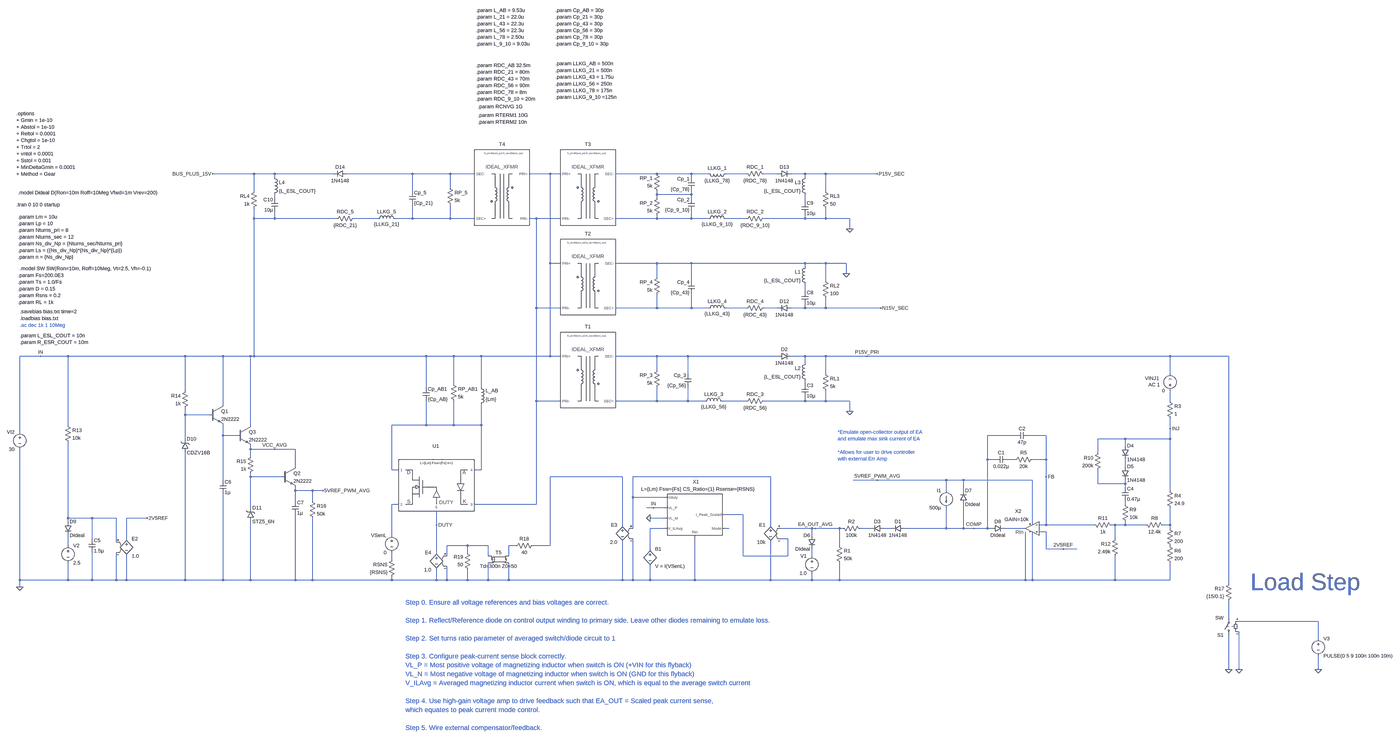
[diagram p0: schematic SU_PSU_Averaged_Model_Diode_Refed_to_Primary_Side.asc, whole sheet]
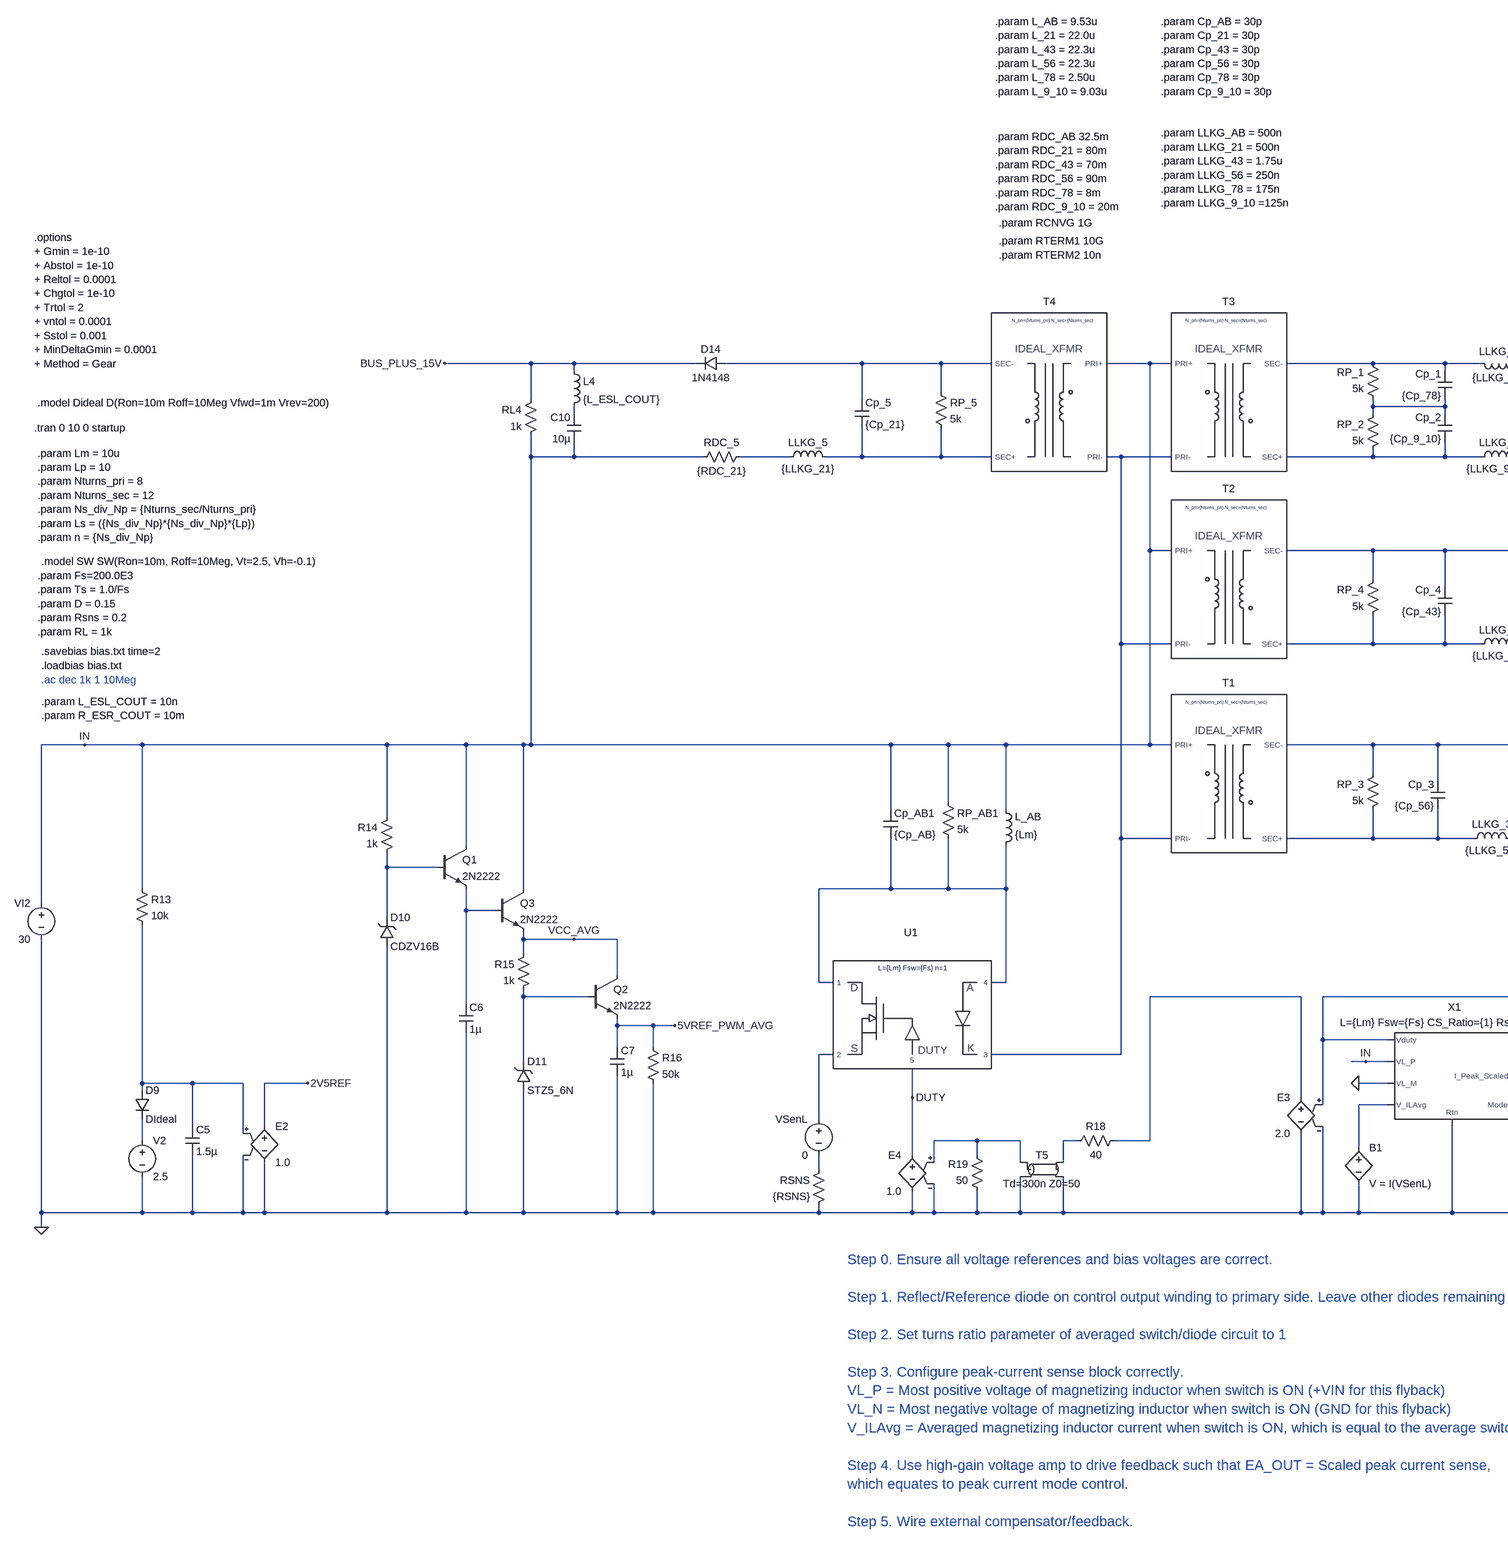
[diagram p1: schematic SU_PSU_Averaged_Model_Diode_Refed_to_Primary_Side.asc, part, row 1 of 1, column 1 of 2]
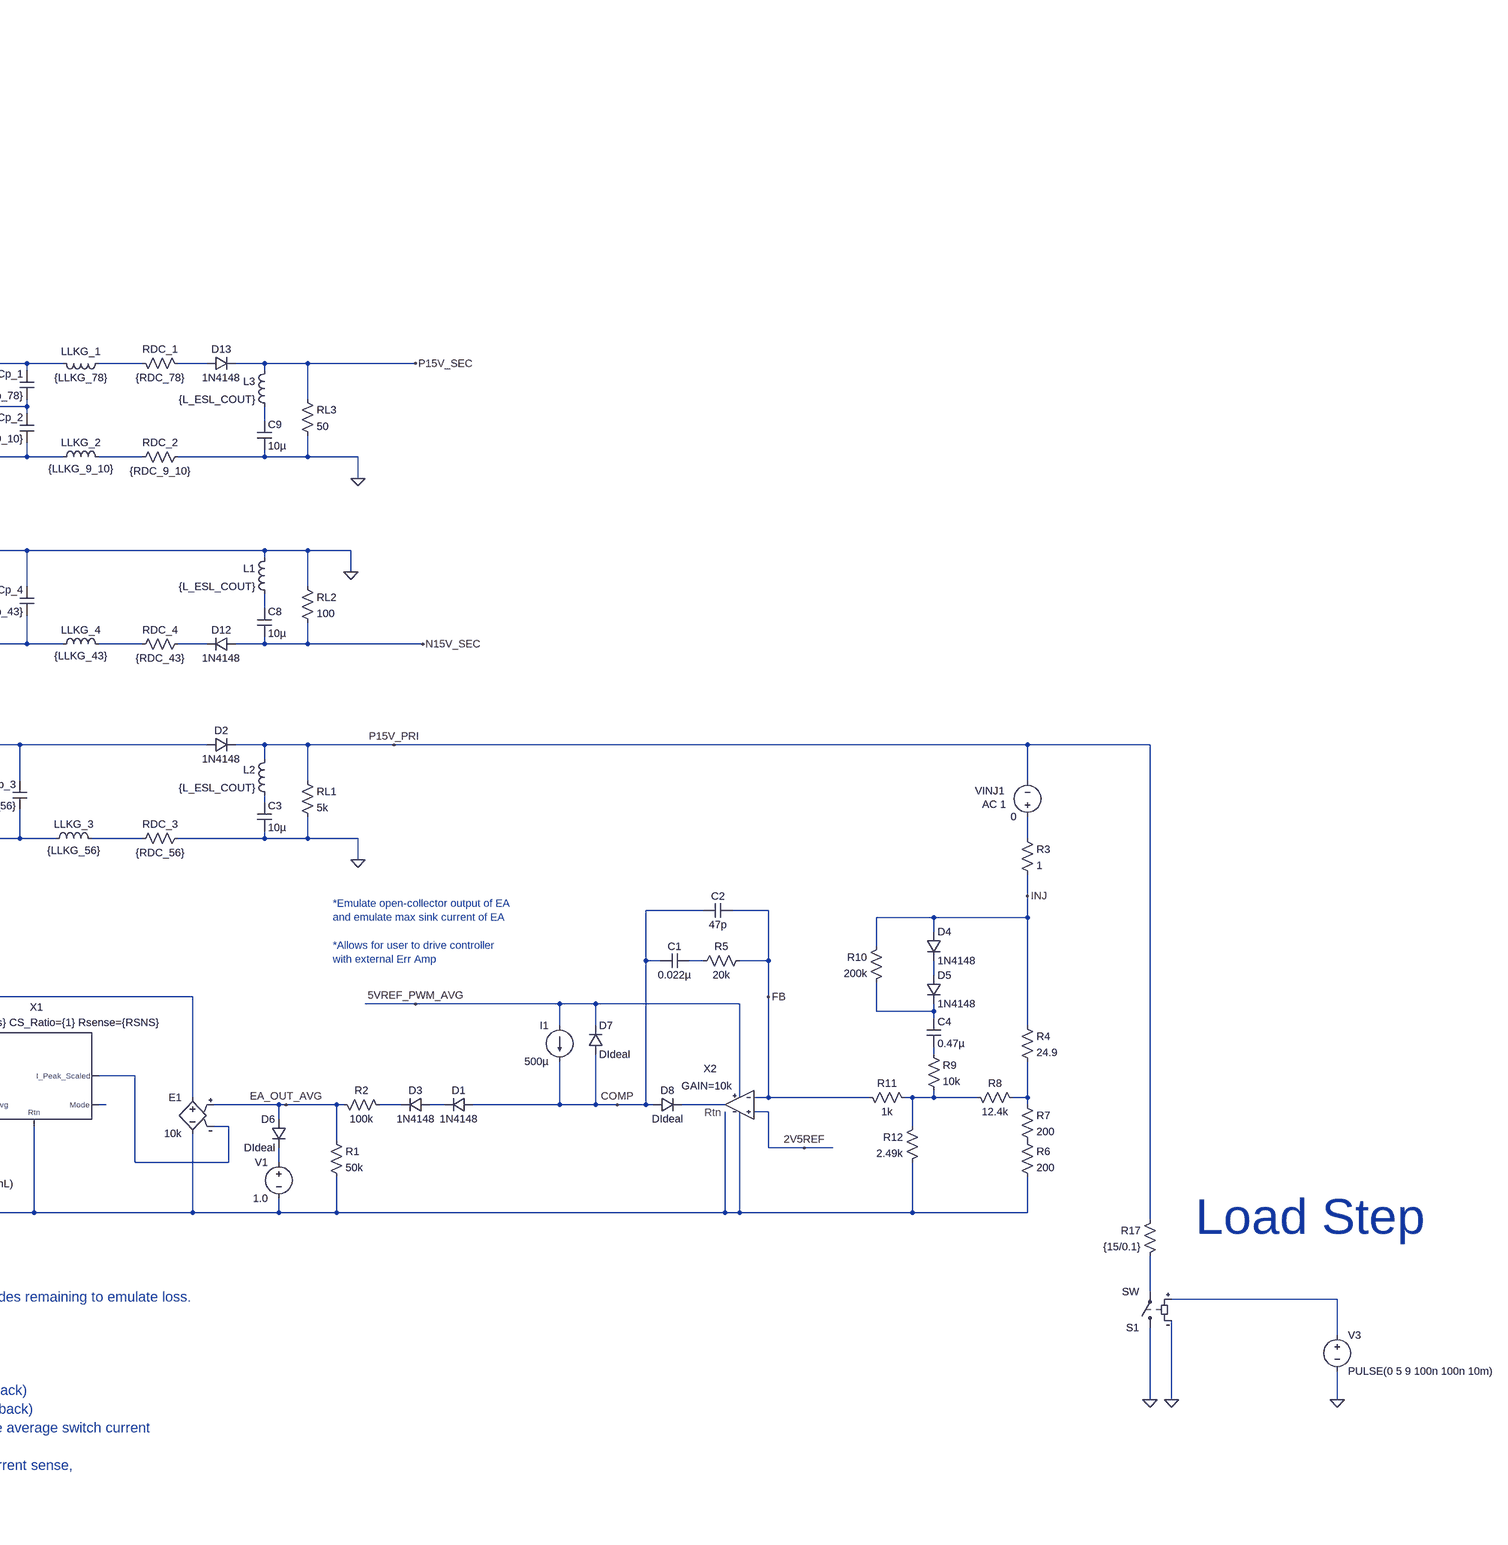
[diagram p2: schematic SU_PSU_Averaged_Model_Diode_Refed_to_Primary_Side.asc, part, row 1 of 1, column 2 of 2]
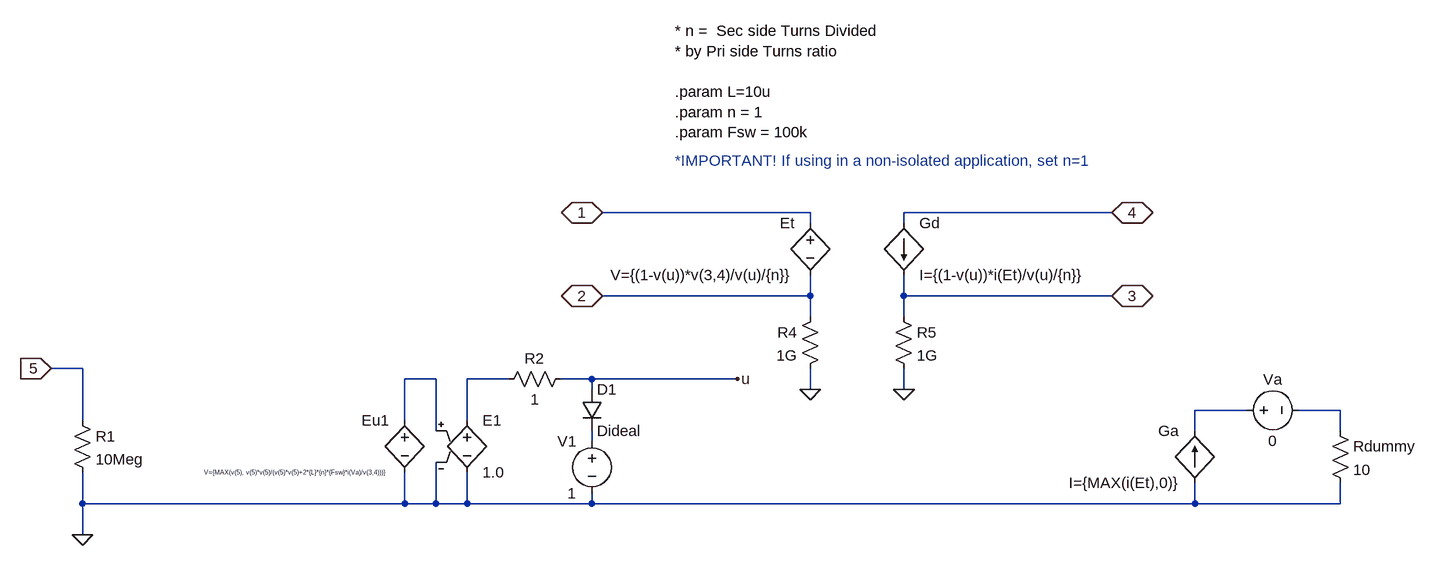
[diagram p3: sub-circuit ccm-dcm2.asc]
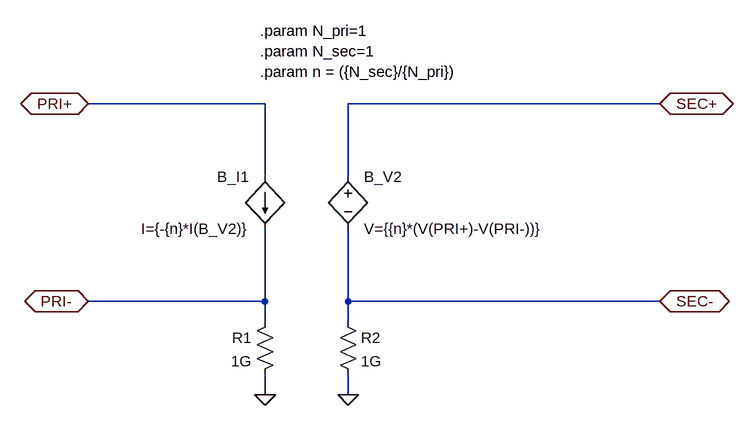
[diagram p4: sub-circuit ideal_dc_xfmr_alt.asc]
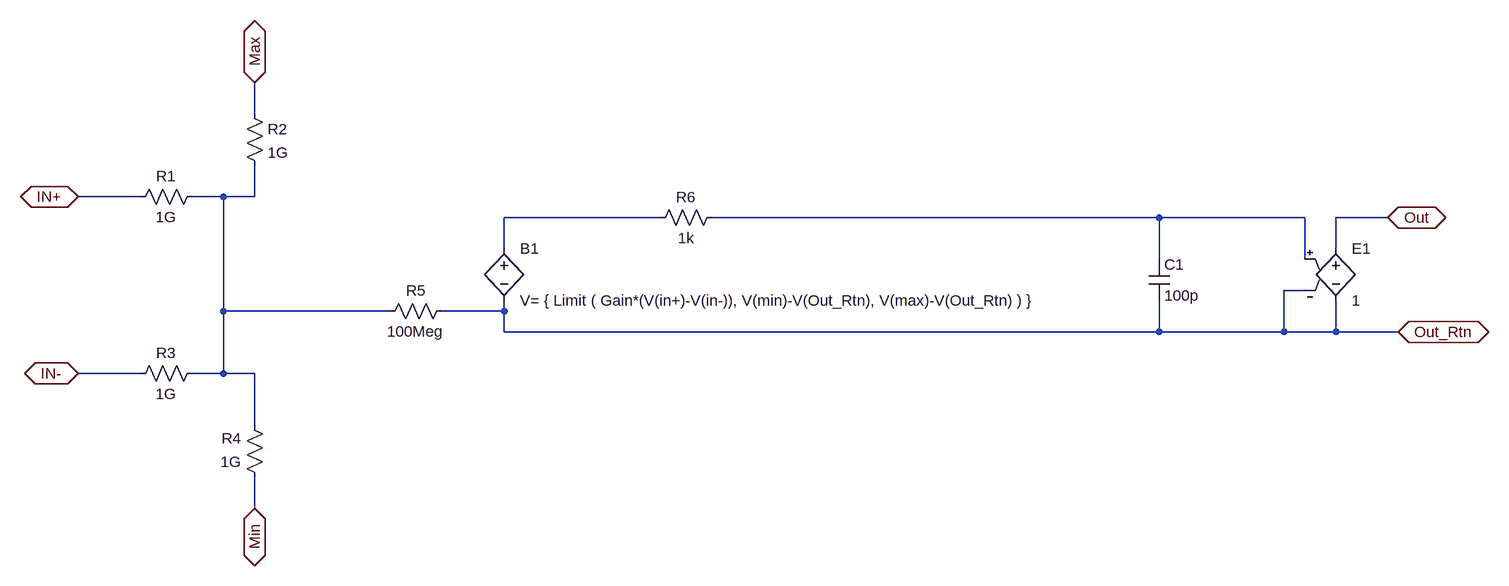
[diagram p5: sub-circuit voltage_amp.asc]
SU_PSU_Averaged_Model_Diode_Refed_to_Primary_Side.asc, the LTspice schematic file:
Version 4.1
SHEET 1 4536 3592
WIRE -912 496 -1104 496
WIRE -816 496 -912 496
WIRE -544 496 -816 496
WIRE -176 496 -480 496
WIRE 0 496 -176 496
WIRE 112 496 0 496
WIRE 464 496 368 496
WIRE 512 496 464 496
WIRE 960 496 768 496
WIRE 1120 496 960 496
WIRE 1200 496 1120 496
WIRE 1376 496 1280 496
WIRE 1520 496 1456 496
WIRE 1648 496 1584 496
WIRE 1744 496 1648 496
WIRE 1984 496 1744 496
WIRE -816 512 -816 496
WIRE 1120 512 1120 496
WIRE 1648 512 1648 496
WIRE 0 560 0 496
WIRE -912 576 -912 496
WIRE -176 576 -176 496
WIRE 1744 576 1744 496
WIRE 960 592 960 576
WIRE 1120 592 1120 576
WIRE 1120 592 960 592
WIRE -816 608 -816 592
WIRE 960 608 960 592
WIRE 1120 608 1120 592
WIRE 1648 624 1648 592
WIRE -912 704 -912 656
WIRE -816 704 -816 672
WIRE -816 704 -912 704
WIRE -528 704 -816 704
WIRE -336 704 -448 704
WIRE -176 704 -176 640
WIRE -176 704 -256 704
WIRE 0 704 0 640
WIRE 0 704 -176 704
WIRE 112 704 0 704
WIRE 400 704 368 704
WIRE 512 704 400 704
WIRE 960 704 960 688
WIRE 960 704 768 704
WIRE 1120 704 1120 672
WIRE 1120 704 960 704
WIRE 1200 704 1120 704
WIRE 1376 704 1280 704
WIRE 1648 704 1648 688
WIRE 1648 704 1456 704
WIRE 1744 704 1744 656
WIRE 1744 704 1648 704
WIRE 1856 704 1744 704
WIRE 1856 752 1856 704
WIRE 464 912 464 496
WIRE 512 912 464 912
WIRE 960 912 768 912
WIRE 1120 912 960 912
WIRE 1648 912 1120 912
WIRE 1744 912 1648 912
WIRE 1840 912 1744 912
WIRE 1648 928 1648 912
WIRE 1840 960 1840 912
WIRE 960 976 960 912
WIRE 1120 992 1120 912
WIRE 1744 992 1744 912
WIRE 1648 1040 1648 1008
WIRE 400 1120 400 704
WIRE 512 1120 400 1120
WIRE 960 1120 960 1056
WIRE 960 1120 768 1120
WIRE 1120 1120 1120 1056
WIRE 1120 1120 960 1120
WIRE 1200 1120 1120 1120
WIRE 1376 1120 1280 1120
WIRE 1520 1120 1456 1120
WIRE 1648 1120 1648 1104
WIRE 1648 1120 1584 1120
WIRE 1744 1120 1744 1072
WIRE 1744 1120 1648 1120
WIRE 2000 1120 1744 1120
WIRE -1904 1344 -2000 1344
WIRE -1776 1344 -1904 1344
WIRE -1232 1344 -1776 1344
WIRE -1056 1344 -1232 1344
WIRE -928 1344 -1056 1344
WIRE -912 1344 -912 704
WIRE -912 1344 -928 1344
WIRE -112 1344 -912 1344
WIRE 16 1344 -112 1344
WIRE 144 1344 16 1344
WIRE 464 1344 464 912
WIRE 464 1344 144 1344
WIRE 512 1344 464 1344
WIRE 960 1344 768 1344
WIRE 1104 1344 960 1344
WIRE 1520 1344 1104 1344
WIRE 1648 1344 1584 1344
WIRE 1744 1344 1648 1344
WIRE 1936 1344 1744 1344
WIRE 3344 1344 1936 1344
WIRE 3648 1344 3344 1344
WIRE 1648 1376 1648 1344
WIRE 960 1408 960 1344
WIRE 1104 1424 1104 1344
WIRE 1744 1424 1744 1344
WIRE 3344 1424 3344 1344
WIRE 16 1472 16 1344
WIRE 1648 1472 1648 1456
WIRE -112 1488 -112 1344
WIRE 144 1488 144 1344
WIRE -1232 1504 -1232 1344
WIRE 400 1552 400 1120
WIRE 512 1552 400 1552
WIRE 960 1552 960 1488
WIRE 960 1552 768 1552
WIRE 1104 1552 1104 1488
WIRE 1104 1552 960 1552
WIRE 1184 1552 1104 1552
WIRE 1376 1552 1264 1552
WIRE 1648 1552 1648 1536
WIRE 1648 1552 1456 1552
WIRE 1744 1552 1744 1504
WIRE 1744 1552 1648 1552
WIRE 1856 1552 1744 1552
WIRE 3344 1552 3344 1504
WIRE -1056 1568 -1056 1344
WIRE 1856 1600 1856 1552
WIRE -1232 1616 -1232 1584
WIRE -1120 1616 -1232 1616
WIRE -1776 1664 -1776 1344
WIRE -928 1664 -928 1344
WIRE -112 1664 -112 1552
WIRE -112 1664 -272 1664
WIRE 16 1664 16 1552
WIRE 16 1664 -112 1664
WIRE 144 1664 144 1568
WIRE 144 1664 16 1664
WIRE 3344 1680 3344 1632
WIRE -2000 1696 -2000 1344
WIRE -1056 1712 -1056 1664
WIRE -992 1712 -1056 1712
WIRE 2624 1712 2496 1712
WIRE 2768 1712 2688 1712
WIRE -1232 1728 -1232 1616
WIRE 3136 1728 3008 1728
WIRE 3344 1728 3344 1680
WIRE 3344 1728 3136 1728
WIRE 3136 1760 3136 1728
WIRE -928 1776 -928 1760
WIRE -816 1776 -928 1776
WIRE -720 1776 -816 1776
WIRE 3008 1792 3008 1728
WIRE -928 1808 -928 1776
WIRE 2496 1824 2496 1712
WIRE 2528 1824 2496 1824
WIRE 2624 1824 2592 1824
WIRE 2768 1824 2768 1712
WIRE 2768 1824 2704 1824
WIRE -720 1856 -720 1776
WIRE 3136 1856 3136 1824
WIRE -272 1872 -272 1664
WIRE -240 1872 -272 1872
WIRE 144 1872 144 1664
WIRE 144 1872 112 1872
WIRE -928 1904 -928 1888
WIRE -784 1904 -928 1904
WIRE 800 1904 464 1904
WIRE 1488 1904 848 1904
WIRE 2768 1904 2768 1824
WIRE -1056 1920 -1056 1712
WIRE 1984 1920 1872 1920
WIRE 2304 1920 1984 1920
WIRE 2384 1920 2304 1920
WIRE 2704 1920 2384 1920
WIRE 3008 1936 3008 1872
WIRE 3136 1936 3136 1920
WIRE 3136 1936 3008 1936
WIRE 3136 1952 3136 1936
WIRE -720 1968 -720 1952
WIRE -640 1968 -720 1968
WIRE -592 1968 -640 1968
WIRE 2304 1968 2304 1920
WIRE 2384 1968 2384 1920
WIRE 3344 1968 3344 1728
WIRE 848 2000 848 1904
WIRE 992 2000 848 2000
WIRE -720 2016 -720 1968
WIRE -640 2016 -640 1968
WIRE -240 2032 -272 2032
WIRE 400 2032 400 1552
WIRE 400 2032 112 2032
WIRE 3136 2032 3136 2016
WIRE -928 2048 -928 1904
WIRE 944 2048 912 2048
WIRE 992 2048 944 2048
WIRE 1360 2080 1280 2080
WIRE -1776 2096 -1776 1744
WIRE -1664 2096 -1776 2096
WIRE -1552 2096 -1664 2096
WIRE -1408 2096 -1504 2096
WIRE 992 2096 928 2096
WIRE -1776 2112 -1776 2096
WIRE -64 2128 -64 2064
WIRE 800 2128 800 1904
WIRE 1488 2128 1488 1904
WIRE 2704 2128 2704 1920
WIRE 2768 2128 2768 1904
WIRE 2768 2128 2736 2128
WIRE 2992 2128 2768 2128
WIRE 3088 2128 3072 2128
WIRE 3136 2128 3136 2112
WIRE 3136 2128 3088 2128
WIRE 3232 2128 3136 2128
WIRE 3344 2128 3344 2048
WIRE 3344 2128 3312 2128
WIRE 848 2144 848 2000
WIRE 992 2144 928 2144
WIRE 1296 2144 1280 2144
WIRE 1680 2144 1536 2144
WIRE 1696 2144 1680 2144
WIRE 1808 2144 1696 2144
WIRE 1824 2144 1808 2144
WIRE 1952 2144 1904 2144
WIRE 2048 2144 2016 2144
WIRE 2304 2144 2304 2048
WIRE 2304 2144 2112 2144
WIRE 2384 2144 2384 2032
WIRE 2384 2144 2304 2144
WIRE 2432 2144 2384 2144
WIRE 2496 2144 2496 1824
WIRE 2496 2144 2432 2144
WIRE 2512 2144 2496 2144
WIRE 2672 2144 2576 2144
WIRE 3344 2144 3344 2128
WIRE 2768 2160 2736 2160
WIRE -272 2176 -272 2032
WIRE 1680 2176 1680 2144
WIRE -1664 2192 -1664 2096
WIRE -1504 2192 -1504 2096
WIRE 1568 2192 1536 2192
WIRE 3088 2192 3088 2128
WIRE -1552 2208 -1552 2096
WIRE -1776 2224 -1776 2176
WIRE 80 2224 -16 2224
WIRE 176 2224 80 2224
WIRE 304 2224 272 2224
WIRE 464 2224 464 1904
WIRE 464 2224 384 2224
WIRE 1808 2224 1808 2144
WIRE 928 2240 928 2144
WIRE 2768 2240 2768 2160
WIRE 2848 2240 2768 2240
WIRE 2912 2240 2848 2240
WIRE -64 2256 -64 2128
WIRE 80 2256 80 2224
WIRE -16 2272 -16 2224
WIRE 176 2272 176 2224
WIRE 272 2272 272 2224
WIRE 1360 2272 1360 2080
WIRE 1568 2272 1568 2192
WIRE 1568 2272 1360 2272
WIRE 1680 2272 1680 2240
WIRE -272 2288 -272 2256
WIRE -2000 2384 -2000 1776
WIRE -1776 2384 -1776 2304
WIRE -1776 2384 -2000 2384
WIRE -1664 2384 -1664 2256
WIRE -1664 2384 -1776 2384
WIRE -1552 2384 -1552 2256
WIRE -1552 2384 -1664 2384
WIRE -1504 2384 -1504 2272
WIRE -1504 2384 -1552 2384
WIRE -1232 2384 -1232 1792
WIRE -1232 2384 -1504 2384
WIRE -1056 2384 -1056 1984
WIRE -1056 2384 -1232 2384
WIRE -928 2384 -928 2112
WIRE -928 2384 -1056 2384
WIRE -720 2384 -720 2080
WIRE -720 2384 -928 2384
WIRE -640 2384 -640 2096
WIRE -640 2384 -720 2384
WIRE -272 2384 -272 2368
WIRE -272 2384 -640 2384
WIRE -64 2384 -64 2336
WIRE -64 2384 -272 2384
WIRE -16 2384 -16 2320
WIRE -16 2384 -64 2384
WIRE 80 2384 80 2336
WIRE 80 2384 -16 2384
WIRE 176 2384 176 2304
WIRE 176 2384 80 2384
WIRE 272 2384 272 2304
WIRE 272 2384 176 2384
WIRE 800 2384 800 2208
WIRE 800 2384 272 2384
WIRE 848 2384 848 2192
WIRE 848 2384 800 2384
WIRE 928 2384 928 2320
WIRE 928 2384 848 2384
WIRE 1136 2384 1136 2192
WIRE 1136 2384 928 2384
WIRE 1488 2384 1488 2208
WIRE 1488 2384 1136 2384
WIRE 1680 2384 1680 2352
WIRE 1680 2384 1488 2384
WIRE 1808 2384 1808 2304
WIRE 1808 2384 1680 2384
WIRE 2672 2384 2672 2160
WIRE 2672 2384 1808 2384
WIRE 2704 2384 2704 2160
WIRE 2704 2384 2672 2384
WIRE 3088 2384 3088 2272
WIRE 3088 2384 2704 2384
WIRE 3344 2384 3344 2304
WIRE 3344 2384 3088 2384
WIRE 3648 2400 3648 1344
WIRE -2000 2416 -2000 2384
WIRE 3648 2560 3648 2480
WIRE 4064 2576 3696 2576
WIRE 4064 2656 4064 2576
WIRE 3648 2800 3648 2640
WIRE 3696 2800 3696 2624
WIRE 4064 2800 4064 2736
FLAG -2000 2416 0
FLAG 1936 1344 P15V_PRI
FLAG -1904 1344 IN
FLAG 1856 1600 0
FLAG 1696 2144 EA_OUT_AVG
FLAG 2848 2240 2V5REF
FLAG 1984 1920 5VREF_PWM_AVG
FLAG 3344 1680 INJ
FLAG 928 2096 0
FLAG 2768 1904 FB
FLAG 2432 2144 COMP
FLAG -1408 2096 2V5REF
FLAG -816 1776 VCC_AVG
FLAG -592 1968 5VREF_PWM_AVG
FLAG -64 2128 DUTY
FLAG 2000 1120 N15V_SEC
FLAG 1840 960 0
FLAG 1984 496 P15V_SEC
FLAG 1856 752 0
FLAG -1104 496 BUS_PLUS_15V
FLAG 3648 2800 0
FLAG 3696 2800 0
FLAG 4064 2800 0
FLAG 944 2048 IN
DATAFLAG 2912 1344 ""
DATAFLAG 1888 1120 ""
DATAFLAG -1024 496 ""
DATAFLAG 1856 496 ""
DATAFLAG 2880 2128 ""
DATAFLAG 2224 2144 ""
DATAFLAG 2224 2144 ""
DATAFLAG 944 1904 ""
DATAFLAG 1568 2144 ""
DATAFLAG -272 2064 ""
SYMBOL voltage -2000 1680 M0
WINDOW 123 0 0 Left 0
WINDOW 39 0 0 Left 0
SYMATTR InstName VI2
SYMATTR Value 30
SYMBOL res 1728 1408 R0
SYMATTR InstName RL1
SYMATTR Value 5k
SYMBOL cap 1632 1472 R0
SYMATTR InstName C3
SYMATTR Value 10µ
SYMBOL ccm-dcm2 -64 1952 R0
WINDOW 39 2 -102 Bottom 1
SYMATTR SpiceLine L={Lm} Fsw={Fs} n=1
SYMATTR InstName U1
SYMBOL res -256 2272 M0
SYMATTR InstName RSNS
SYMATTR Value {RSNS}
SYMBOL ind 128 1584 M180
WINDOW 0 36 80 Left 2
WINDOW 3 36 40 Left 2
SYMATTR InstName L_AB
SYMATTR Value {Lm}
SYMBOL IDEAL_DC_XFMR_ALT 640 1440 R0
WINDOW 0 -1 -218 Bottom 2
WINDOW 39 -7 -184 Bottom 0
SYMATTR InstName T1
SYMATTR SpiceLine N_pri={Nturns_pri} N_sec={Nturns_sec}
SYMBOL diode 1520 1360 R270
WINDOW 0 32 32 VTop 2
WINDOW 3 0 32 VBottom 2
SYMATTR InstName D2
SYMATTR Value 1N4148
SYMBOL Peak_Current_Sense 1136 2080 R0
WINDOW 0 5 -137 Bottom 2
WINDOW 39 14 -103 Bottom 2
SYMATTR InstName X1
SYMATTR SpiceLine L={Lm} Fsw={Fs} CS_Ratio={1} Rsense={RSNS}
SYMBOL bv 928 2224 R0
SYMATTR InstName B1
SYMATTR Value V = I(VSenL)
SYMBOL diode 2112 2160 M270
WINDOW 0 32 32 VTop 2
WINDOW 3 0 32 VBottom 2
SYMATTR InstName D1
SYMATTR Value 1N4148
SYMBOL diode 2016 2160 M270
WINDOW 0 32 32 VTop 2
WINDOW 3 0 32 VBottom 2
SYMATTR InstName D3
SYMATTR Value 1N4148
SYMBOL res 1792 2208 R0
SYMATTR InstName R1
SYMATTR Value 50k
SYMBOL res 1920 2160 M270
WINDOW 0 32 56 VTop 2
WINDOW 3 0 56 VBottom 2
SYMATTR InstName R2
SYMATTR Value 100k
SYMBOL res 3328 1536 R0
SYMATTR InstName R3
SYMATTR Value 1
SYMBOL res 3328 1952 R0
SYMATTR InstName R4
SYMATTR Value 24.9
SYMBOL cap 2592 1808 R90
WINDOW 0 0 32 VBottom 2
WINDOW 3 32 32 VTop 2
SYMATTR InstName C1
SYMATTR Value 0.022µ
SYMBOL res 2720 1808 R90
WINDOW 0 0 56 VBottom 2
WINDOW 3 32 56 VTop 2
SYMATTR InstName R5
SYMATTR Value 20k
SYMBOL cap 2688 1696 R90
WINDOW 0 0 32 VBottom 2
WINDOW 3 32 32 VTop 2
SYMATTR InstName C2
SYMATTR Value 47p
SYMBOL res 3328 2208 R0
SYMATTR InstName R6
SYMATTR Value 200
SYMBOL res 3328 2128 R0
SYMATTR InstName R7
SYMATTR Value 200
SYMBOL res 3216 2112 M90
WINDOW 0 0 56 VBottom 2
WINDOW 3 32 56 VTop 2
SYMATTR InstName R8
SYMATTR Value 12.4k
SYMBOL res 3120 2016 R0
SYMATTR InstName R9
SYMATTR Value 10k
SYMBOL cap 3120 1952 R0
SYMATTR InstName C4
SYMATTR Value 0.47µ
SYMBOL res 3024 1776 M0
SYMATTR InstName R10
SYMATTR Value 200k
SYMBOL res 2976 2112 M90
WINDOW 0 0 56 VBottom 2
WINDOW 3 32 56 VTop 2
SYMATTR InstName R11
SYMATTR Value 1k
SYMBOL res 3104 2176 M0
SYMATTR InstName R12
SYMATTR Value 2.49k
SYMBOL e 1488 2112 M0
SYMATTR InstName E1
SYMATTR Value 10k
SYMBOL diode 3120 1760 R0
SYMATTR InstName D4
SYMATTR Value 1N4148
SYMBOL diode 3120 1856 R0
SYMATTR InstName D5
SYMATTR Value 1N4148
SYMBOL voltage 1680 2256 M0
WINDOW 123 0 0 Left 0
WINDOW 39 0 0 Left 0
SYMATTR InstName V1
SYMATTR Value 1.0
SYMBOL diode 1696 2176 M0
SYMATTR InstName D6
SYMATTR Value DIdeal
SYMBOL current 2304 1968 M0
WINDOW 123 0 0 Left 0
WINDOW 39 0 0 Left 0
SYMATTR InstName I1
SYMATTR Value 500µ
SYMBOL diode 2368 2032 M180
WINDOW 0 24 64 Left 2
WINDOW 3 24 0 Left 2
SYMATTR InstName D7
SYMATTR Value DIdeal
SYMBOL diode 2512 2128 M90
WINDOW 0 0 32 VBottom 2
WINDOW 3 32 32 VTop 2
SYMATTR InstName D8
SYMATTR Value DIdeal
SYMBOL voltage 3344 1520 R180
WINDOW 0 51 74 Left 2
WINDOW 3 24 16 Left 2
WINDOW 123 47 44 Left 2
WINDOW 39 0 0 Left 0
SYMATTR InstName VINJ1
SYMATTR Value 0
SYMATTR Value2 AC 1
SYMBOL voltage -1776 2208 R0
WINDOW 123 0 0 Left 0
WINDOW 39 0 0 Left 0
SYMATTR InstName V2
SYMATTR Value 2.5
SYMBOL res -1792 1648 R0
SYMATTR InstName R13
SYMATTR Value 10k
SYMBOL diode -1792 2112 R0
SYMATTR InstName D9
SYMATTR Value DIdeal
SYMBOL cap -1680 2192 R0
SYMATTR InstName C5
SYMATTR Value 1.5µ
SYMBOL zener -1248 1792 M180
WINDOW 0 24 64 Left 2
WINDOW 3 24 0 Left 2
SYMATTR InstName D10
SYMATTR Value CDZV16B
SYMBOL res -1216 1488 M0
SYMATTR InstName R14
SYMATTR Value 1k
SYMBOL npn -1120 1568 R0
SYMATTR InstName Q1
SYMATTR Value 2N2222
SYMBOL cap -1072 1920 R0
SYMATTR InstName C6
SYMATTR Value 1µ
SYMBOL zener -944 2112 M180
WINDOW 0 24 64 Left 2
WINDOW 3 24 0 Left 2
SYMATTR InstName D11
SYMATTR Value STZ5_6N
SYMBOL res -912 1792 M0
SYMATTR InstName R15
SYMATTR Value 1k
SYMBOL npn -784 1856 R0
SYMATTR InstName Q2
SYMATTR Value 2N2222
SYMBOL cap -736 2016 R0
SYMATTR InstName C7
SYMATTR Value 1µ
SYMBOL res -656 2000 R0
SYMATTR InstName R16
SYMATTR Value 50k
SYMBOL npn -992 1664 R0
SYMATTR InstName Q3
SYMATTR Value 2N2222
SYMBOL voltage -272 2160 M0
WINDOW 123 0 0 Left 0
WINDOW 39 0 0 Left 0
SYMATTR InstName VSenL
SYMATTR Value 0
SYMBOL Voltage_Amp 2720 2144 M0
WINDOW 0 81 -65 Bottom 2
WINDOW 39 89 -26 Bottom 2
SYMATTR InstName X2
SYMATTR SpiceLine GAIN=10k
SYMBOL e -1504 2176 R0
SYMATTR InstName E2
SYMATTR Value 1.0
SYMBOL res 1728 976 R0
SYMATTR InstName RL2
SYMATTR Value 100
SYMBOL cap 1632 1040 R0
SYMATTR InstName C8
SYMATTR Value 10µ
SYMBOL IDEAL_DC_XFMR_ALT 640 1008 R0
WINDOW 0 -1 -218 Bottom 2
WINDOW 39 -7 -184 Bottom 0
SYMATTR InstName T2
SYMATTR SpiceLine N_pri={Nturns_pri} N_sec={Nturns_sec}
SYMBOL diode 1584 1104 R90
WINDOW 0 0 32 VBottom 2
WINDOW 3 32 32 VTop 2
SYMATTR InstName D12
SYMATTR Value 1N4148
SYMBOL res 1728 560 R0
SYMATTR InstName RL3
SYMATTR Value 50
SYMBOL cap 1632 624 R0
SYMATTR InstName C9
SYMATTR Value 10µ
SYMBOL IDEAL_DC_XFMR_ALT 640 592 R0
WINDOW 0 -1 -218 Bottom 2
WINDOW 39 -7 -184 Bottom 0
SYMATTR InstName T3
SYMATTR SpiceLine N_pri={Nturns_pri} N_sec={Nturns_sec}
SYMBOL diode 1520 512 R270
WINDOW 0 32 32 VTop 2
WINDOW 3 0 32 VBottom 2
SYMATTR InstName D13
SYMATTR Value 1N4148
SYMBOL res -896 560 M0
SYMATTR InstName RL4
SYMATTR Value 1k
SYMBOL cap -800 608 M0
SYMATTR InstName C10
SYMATTR Value 10µ
SYMBOL IDEAL_DC_XFMR_ALT 240 592 M0
WINDOW 0 -1 -218 Bottom 2
WINDOW 39 -7 -184 Bottom 0
SYMATTR InstName T4
SYMATTR SpiceLine N_pri={Nturns_pri} N_sec={Nturns_sec}
SYMBOL diode -480 512 M270
WINDOW 0 32 32 VTop 2
WINDOW 3 0 32 VBottom 2
SYMATTR InstName D14
SYMATTR Value 1N4148
SYMBOL res 1472 512 M270
WINDOW 0 32 56 VTop 2
WINDOW 3 0 56 VBottom 2
SYMATTR InstName RDC_1
SYMATTR Value {RDC_78}
SYMBOL res 1472 688 R90
WINDOW 0 0 56 VBottom 2
WINDOW 3 32 56 VTop 2
SYMATTR InstName RDC_2
SYMATTR Value {RDC_9_10}
SYMBOL ind 1296 480 R90
WINDOW 0 5 56 VBottom 2
WINDOW 3 32 56 VTop 2
SYMATTR InstName LLKG_1
SYMATTR Value {LLKG_78}
SYMBOL cap 1136 576 R180
WINDOW 0 24 56 Left 2
WINDOW 3 24 8 Left 2
SYMATTR InstName Cp_1
SYMATTR Value {Cp_78}
SYMBOL res 976 592 R180
WINDOW 0 36 76 Left 2
WINDOW 3 36 40 Left 2
SYMATTR InstName RP_1
SYMATTR Value 5k
SYMBOL ind 1296 720 M270
WINDOW 0 32 56 VTop 2
WINDOW 3 5 56 VBottom 2
SYMATTR InstName LLKG_2
SYMATTR Value {LLKG_9_10}
SYMBOL cap 1136 608 M0
SYMATTR InstName Cp_2
SYMATTR Value {Cp_9_10}
SYMBOL res 976 592 M0
SYMATTR InstName RP_2
SYMATTR Value 5k
SYMBOL res 1472 1536 R90
WINDOW 0 0 56 VBottom 2
WINDOW 3 32 56 VTop 2
SYMATTR InstName RDC_3
SYMATTR Value {RDC_56}
SYMBOL ind 1280 1568 M270
WINDOW 0 32 56 VTop 2
WINDOW 3 5 56 VBottom 2
SYMATTR InstName LLKG_3
SYMATTR Value {LLKG_56}
SYMBOL cap 1120 1424 M0
SYMATTR InstName Cp_3
SYMATTR Value {Cp_56}
SYMBOL res 976 1392 M0
SYMATTR InstName RP_3
SYMATTR Value 5k
SYMBOL res 1472 1104 R90
WINDOW 0 0 56 VBottom 2
WINDOW 3 32 56 VTop 2
SYMATTR InstName RDC_4
SYMATTR Value {RDC_43}
SYMBOL ind 1296 1136 M270
WINDOW 0 32 56 VTop 2
WINDOW 3 5 56 VBottom 2
SYMATTR InstName LLKG_4
SYMATTR Value {LLKG_43}
SYMBOL cap 1136 992 M0
SYMATTR InstName Cp_4
SYMATTR Value {Cp_43}
SYMBOL res 976 960 M0
SYMATTR InstName RP_4
SYMATTR Value 5k
SYMBOL res -432 688 R90
WINDOW 0 0 56 VBottom 2
WINDOW 3 32 56 VTop 2
SYMATTR InstName RDC_5
SYMATTR Value {RDC_21}
SYMBOL ind -352 720 R270
WINDOW 0 32 56 VTop 2
WINDOW 3 5 56 VBottom 2
SYMATTR InstName LLKG_5
SYMATTR Value {LLKG_21}
SYMBOL cap -192 576 R0
SYMATTR InstName Cp_5
SYMATTR Value {Cp_21}
SYMBOL res -16 544 R0
SYMATTR InstName RP_5
SYMATTR Value 5k
SYMBOL sw 3648 2656 R180
SYMATTR InstName S1
SYMBOL res 3664 2384 M0
SYMATTR InstName R17
SYMATTR Value {15/0.1}
SYMBOL voltage 4064 2640 R0
WINDOW 123 0 0 Left 0
WINDOW 39 0 0 Left 0
SYMATTR InstName V3
SYMATTR Value PULSE(0 5 9 100n 100n 10m)
SYMBOL cap -128 1488 R0
SYMATTR InstName Cp_AB1
SYMATTR Value {Cp_AB}
SYMBOL res 0 1456 R0
SYMATTR InstName RP_AB1
SYMATTR Value 5k
SYMBOL ind 1664 912 M0
SYMATTR InstName L1
SYMATTR Value {L_ESL_COUT}
SYMATTR SpiceLine Rser={R_ESR_COUT}
SYMBOL ind 1664 1360 M0
SYMATTR InstName L2
SYMATTR Value {L_ESL_COUT}
SYMATTR SpiceLine Rser={R_ESR_COUT}
SYMBOL ind 1664 496 M0
SYMATTR InstName L3
SYMATTR Value {L_ESL_COUT}
SYMATTR SpiceLine Rser={R_ESR_COUT}
SYMBOL ind -832 496 R0
SYMATTR InstName L4
SYMATTR Value {L_ESL_COUT}
SYMATTR SpiceLine Rser={R_ESR_COUT}
SYMBOL e 800 2112 M0
SYMATTR InstName E3
SYMATTR Value 2.0
SYMBOL e -64 2240 M0
SYMATTR InstName E4
SYMATTR Value 1.0
SYMBOL tline 224 2288 R0
SYMATTR InstName T5
SYMATTR Value Td=300n Z0=50
SYMBOL res 400 2208 R90
WINDOW 0 0 56 VBottom 2
WINDOW 3 32 56 VTop 2
SYMATTR InstName R18
SYMATTR Value 40
SYMBOL res 96 2352 R180
WINDOW 0 36 76 Left 2
WINDOW 3 36 40 Left 2
SYMATTR InstName R19
SYMATTR Value 50
TEXT -2016 640 Left 2 !.tran 0 10 0 startup
TEXT -2000 936 Left 2 !.model SW SW(Ron=10m, Roff=10Meg, Vt=2.5, Vh=-0.1)
TEXT -2008 968 Left 2 !.param Fs=200.0E3\n.param Ts = 1.0/Fs\n.param D = 0.15\n.param Rsns = 0.2\n.param RL = 1k
TEXT -2008 584 Left 2 !.model Dideal D(Ron=10m Roff=10Meg Vfwd=1m Vrev=200)
TEXT -2008 696 Left 2 !.param Lm = 10u\n.param Lp = 10\n.param Nturns_pri = 8\n.param Nturns_sec = 12\n.param Ns_div_Np = {Nturns_sec/Nturns_pri}\n.param Ls = ({Ns_div_Np}*{Ns_div_Np}*{Lp})\n.param n = {Ns_div_Np}
TEXT 1800 1696 Left 2 ;*Emulate open-collector output of EA\nand emulate max sink current of EA\n \n*Allows for user to drive controller\nwith external Err Amp
TEXT -2000 1136 Left 2 !.savebias bias.txt time=2
TEXT -2000 1168 Left 2 !.loadbias bias.txt
TEXT -2000 1200 Left 2 ;.ac dec 1k 1 10Meg
TEXT -208 2488 Left 3 ;Step 0. Ensure all voltage references and bias voltages are correct.\n \nStep 1. Reflect/Reference diode on control output winding to primary side. Leave other diodes remaining to emulate loss.\n \nStep 2. Set turns ratio parameter of averaged switch/diode circuit to 1\n \nStep 3. Configure peak-current sense block correctly.\nVL_P = Most positive voltage of magnetizing inductor when switch is ON (+VIN for this flyback)\nVL_N = Most negative voltage of magnetizing inductor when switch is ON (GND for this flyback)\nV_ILAvg = Averaged magnetizing inductor current when switch is ON, which is equal to the average switch current\n \nStep 4. Use high-gain voltage amp to drive feedback such that EA_OUT = Scaled peak current sense,\nwhich equates to peak current mode control.\n \nStep 5. Wire external compensator/feedback.
TEXT 120 -264 Left 2 !.param L_AB = 9.53u\n.param L_21 = 22.0u\n.param L_43 = 22.3u\n.param L_56 = 22.3u\n.param L_78 = 2.50u\n.param L_9_10 = 9.03u
TEXT 120 -8 Left 2 !.param RDC_AB 32.5m\n.param RDC_21 = 80m\n.param RDC_43 = 70m\n.param RDC_56 = 90m\n.param RDC_78 = 8m\n.param RDC_9_10 = 20m
TEXT 128 184 Left 2 !.param RCNVG 1G
TEXT 488 -16 Left 2 !.param LLKG_AB = 500n\n.param LLKG_21 = 500n\n.param LLKG_43 = 1.75u\n.param LLKG_56 = 250n\n.param LLKG_78 = 175n\n.param LLKG_9_10 =125n
TEXT 488 -264 Left 2 !.param Cp_AB = 30p\n.param Cp_21 = 30p\n.param Cp_43 = 30p\n.param Cp_56 = 30p\n.param Cp_78 = 30p\n.param Cp_9_10 = 30p
TEXT 128 224 Left 2 !.param RTERM1 10G\n.param RTERM2 10n
TEXT 4264 2392 Right 7 ;Load Step
TEXT -2016 216 Left 2 !.options\n+ Gmin = 1e-10\n+ Abstol = 1e-10\n+ Reltol = 0.0001\n+ Chgtol = 1e-10\n+ Trtol = 2\n+ vntol = 0.0001\n+ Sstol = 0.001\n+ MinDeltaGmin = 0.0001\n+ Method = Gear
TEXT -2000 1248 Left 2 !.param L_ESL_COUT = 10n\n.param R_ESR_COUT = 10m

ccm-dcm2.asc, the sub-circuit schematic file:
Version 4.1
SHEET 1 1388 680
WIRE 432 -224 112 -224
WIRE 896 -224 576 -224
WIRE 432 -208 432 -224
WIRE 576 -208 576 -224
WIRE 432 -96 432 -128
WIRE 432 -96 112 -96
WIRE 576 -96 576 -128
WIRE 896 -96 576 -96
WIRE 432 -64 432 -96
WIRE 576 -64 576 -96
WIRE -688 16 -736 16
WIRE -144 32 -192 32
WIRE -32 32 -96 32
WIRE 96 32 48 32
WIRE 320 32 96 32
WIRE 96 48 96 32
WIRE 432 48 432 16
WIRE 576 48 576 16
WIRE 1104 80 1024 80
WIRE 1248 80 1184 80
WIRE -688 96 -688 16
WIRE -192 96 -192 32
WIRE -96 96 -96 32
WIRE -144 112 -144 32
WIRE 1024 112 1024 80
WIRE 1248 112 1248 80
WIRE 96 128 96 112
WIRE -688 224 -688 176
WIRE -192 224 -192 176
WIRE -192 224 -688 224
WIRE -144 224 -144 160
WIRE -144 224 -192 224
WIRE -96 224 -96 176
WIRE -96 224 -144 224
WIRE 96 224 96 208
WIRE 96 224 -96 224
WIRE 1024 224 1024 192
WIRE 1024 224 96 224
WIRE 1248 224 1248 192
WIRE 1248 224 1024 224
WIRE -688 272 -688 224
FLAG -736 16 5
IOPIN -736 16 In
FLAG 320 32 u
FLAG 896 -224 4
IOPIN 896 -224 BiDir
FLAG 896 -96 3
IOPIN 896 -96 BiDir
FLAG 112 -224 1
IOPIN 112 -224 BiDir
FLAG 112 -96 2
IOPIN 112 -96 BiDir
FLAG -688 272 0
FLAG 432 48 0
FLAG 576 48 0
SYMBOL bv -192 80 M0
WINDOW 3 24 96 Left 0
SYMATTR Value V={MAX(v(5), v(5)*v(5)/(v(5)*v(5)+2*{L}*{n}*{Fsw}*i(Va)/v(3,4)))}
SYMATTR InstName Eu1
SYMBOL bv 432 -224 M0
SYMATTR InstName Et
SYMATTR Value V={(1-v(u))*v(3,4)/v(u)/{n}}
SYMBOL bi 576 -208 R0
SYMATTR InstName Gd
SYMATTR Value I={(1-v(u))*i(Et)/v(u)/{n}}
SYMBOL bi 1024 192 R180
WINDOW 0 24 80 Left 2
WINDOW 3 24 0 Left 2
SYMATTR InstName Ga
SYMATTR Value I={MAX(i(Et),0)}
SYMBOL voltage 1088 80 R270
WINDOW 0 32 56 VTop 2
WINDOW 3 -32 56 VBottom 2
WINDOW 123 0 0 Left 0
WINDOW 39 0 0 Left 0
SYMATTR InstName Va
SYMATTR Value 0
SYMBOL res 1232 96 R0
SYMATTR InstName Rdummy
SYMATTR Value 10
SYMBOL e -96 80 R0
SYMATTR InstName E1
SYMATTR Value 1.0
SYMBOL res 64 16 R90
WINDOW 0 0 56 VBottom 2
WINDOW 3 32 56 VTop 2
SYMATTR InstName R2
SYMATTR Value 1
SYMBOL diode 80 48 R0
SYMATTR InstName D1
SYMATTR Value Dideal
SYMBOL voltage 96 112 M0
WINDOW 123 0 0 Left 0
WINDOW 39 0 0 Left 0
SYMATTR InstName V1
SYMATTR Value 1
SYMBOL res -704 80 R0
SYMATTR InstName R1
SYMATTR Value 10Meg
SYMBOL res 448 -80 M0
SYMATTR InstName R4
SYMATTR Value 1G
SYMBOL res 560 -80 R0
SYMATTR InstName R5
SYMATTR Value 1G
TEXT 224 -504 Left 2 !* n =  Sec side Turns Divided\n* by Pri side Turns ratio\n \n.param L=10u\n.param n = 1\n.param Fsw = 100k
TEXT 224 -304 Left 2 ;*IMPORTANT! If using in a non-isolated application, set n=1

ideal_dc_xfmr_alt.asc, the sub-circuit schematic file:
Version 4.1
SHEET 1 996 680
WIRE 192 112 -80 112
WIRE 800 112 320 112
WIRE 192 224 192 112
WIRE 320 224 320 112
WIRE 192 416 192 304
WIRE 192 416 -80 416
WIRE 320 416 320 304
WIRE 800 416 320 416
WIRE 192 448 192 416
WIRE 320 448 320 416
WIRE 192 560 192 528
WIRE 320 560 320 528
FLAG -80 112 PRI+
IOPIN -80 112 BiDir
FLAG -80 416 PRI-
IOPIN -80 416 BiDir
FLAG 800 112 SEC+
IOPIN 800 112 BiDir
FLAG 800 416 SEC-
IOPIN 800 416 BiDir
FLAG 320 560 0
FLAG 192 560 0
SYMBOL bv 320 208 R0
SYMATTR InstName B_V2
SYMATTR Value V={{n}*(V(PRI+)-V(PRI-))}
SYMBOL bi 192 224 M0
SYMATTR InstName B_I1
SYMATTR Value I={-{n}*I(B_V2)}
SYMBOL res 208 432 M0
SYMATTR InstName R1
SYMATTR Value 1G
SYMBOL res 304 432 R0
SYMATTR InstName R2
SYMATTR Value 1G
TEXT 184 0 Left 2 !.param N_pri=1\n.param N_sec=1\n.param n = ({N_sec}/{N_pri})

voltage_amp.asc, the sub-circuit schematic file:
Version 4.1
SHEET 1 2092 680
WIRE 176 -80 176 -128
WIRE 0 48 -96 48
WIRE 128 48 80 48
WIRE 176 48 176 0
WIRE 176 48 128 48
WIRE 800 80 560 80
WIRE 1568 80 880 80
WIRE 1792 80 1568 80
WIRE 1920 80 1840 80
WIRE 560 128 560 80
WIRE 1840 128 1840 80
WIRE 1568 144 1568 80
WIRE 1792 144 1792 80
WIRE 1792 192 1760 192
WIRE 128 224 128 48
WIRE 384 224 128 224
WIRE 560 224 560 208
WIRE 560 224 464 224
WIRE 560 256 560 224
WIRE 1568 256 1568 208
WIRE 1568 256 560 256
WIRE 1760 256 1760 192
WIRE 1760 256 1568 256
WIRE 1840 256 1840 208
WIRE 1840 256 1760 256
WIRE 1936 256 1840 256
WIRE 0 320 -96 320
WIRE 128 320 128 224
WIRE 128 320 80 320
WIRE 176 320 128 320
WIRE 176 400 176 320
WIRE 176 528 176 480
FLAG 176 -128 Max
IOPIN 176 -128 BiDir
FLAG -96 320 IN-
IOPIN -96 320 BiDir
FLAG 176 528 Min
IOPIN 176 528 BiDir
FLAG -96 48 IN+
IOPIN -96 48 BiDir
FLAG 1920 80 Out
IOPIN 1920 80 BiDir
FLAG 1936 256 Out_Rtn
IOPIN 1936 256 BiDir
SYMBOL res 96 32 R90
WINDOW 0 0 56 VBottom 2
WINDOW 3 32 56 VTop 2
SYMATTR InstName R1
SYMATTR Value 1G
SYMBOL res 160 -96 R0
SYMATTR InstName R2
SYMATTR Value 1G
SYMBOL res 96 304 R90
WINDOW 0 0 56 VBottom 2
WINDOW 3 32 56 VTop 2
SYMATTR InstName R3
SYMATTR Value 1G
SYMBOL res 192 496 R180
WINDOW 0 36 76 Left 2
WINDOW 3 36 40 Left 2
SYMATTR InstName R4
SYMATTR Value 1G
SYMBOL res 480 208 R90
WINDOW 0 0 56 VBottom 2
WINDOW 3 32 56 VTop 2
SYMATTR InstName R5
SYMATTR Value 100Meg
SYMBOL bv 560 112 R0
SYMATTR InstName B1
SYMATTR Value V= { Limit ( Gain*(V(in+)-V(in-)), V(min)-V(Out_Rtn), V(max)-V(Out_Rtn) ) }
SYMBOL res 896 64 R90
WINDOW 0 0 56 VBottom 2
WINDOW 3 32 56 VTop 2
SYMATTR InstName R6
SYMATTR Value 1k
SYMBOL cap 1552 144 R0
SYMATTR InstName C1
SYMATTR Value 100p
SYMBOL e 1840 112 R0
SYMATTR InstName E1
SYMATTR Value 1

The netlist it stands for:
* SU_PSU_Averaged_Model_Diode_Refed_to_Primary_Side.asc
VI2 IN 0 30
RL1 P15V_PRI 0 5k
C3 N018 0 10µ
X§U1 DUTY N023 N031 N010 N023 ccm-dcm2 params: L={Lm} Fsw={Fs} n=1
RSNS N046 0 {RSNS}
L_AB N023 IN {Lm}
X§T1 IN N010 N019 N017 ideal_dc_xfmr_alt params: N_pri={Nturns_pri} N_sec={Nturns_sec}
D2 N017 P15V_PRI 1N4148
X§X1 N033 0 N037 N029 0 IN N038 Peak_Current_Sense params: L={Lm} Fsw={Fs} CS_Ratio={1} Rsense={RSNS}  ; pins I_Peak_Scaled Rtn V_ILAvg Vduty VL_M VL_P Mode
B1 N037 0 V = I(VSenL)
D1 COMP N040 1N4148
D3 N040 N039 1N4148
R1 EA_OUT_AVG 0 50k
R2 N039 EA_OUT_AVG 100k
R3 N021 INJ 1
R4 INJ N036 24.9
C1 N025 COMP 0.022µ
R5 FB N025 20k
C2 FB COMP 47p
R6 P001 0 200
R7 N036 P001 200
R8 N035 N036 12.4k
R9 N032 N035 10k
C4 N030 N032 0.47µ
R10 INJ N030 200k
R11 FB N035 1k
R12 N035 0 2.49k
E1 N029 0 EA_OUT_AVG N033 10k
D4 INJ N026 1N4148
D5 N026 N030 1N4148
V1 N045 0 1.0
D6 EA_OUT_AVG N045 DIdeal
I1 5VREF_PWM_AVG COMP 500µ
D7 COMP 5VREF_PWM_AVG DIdeal
D8 COMP N041 DIdeal
VINJ1 N021 P15V_PRI 0 AC 1
V2 N042 0 2.5
R13 IN N034 10k
D9 N034 N042 DIdeal
C5 N034 0 1.5µ
D10 0 N022 CDZV16B
R14 IN N022 1k
Q1 IN N022 N024 0 2N2222
C6 N024 0 1µ
D11 0 N027 STZ5_6N
R15 VCC_AVG N027 1k
Q2 VCC_AVG N027 5VREF_PWM_AVG 0 2N2222
C7 5VREF_PWM_AVG 0 1µ
R16 5VREF_PWM_AVG 0 50k
Q3 IN N024 VCC_AVG 0 2N2222
VSenL N031 N046 0
X§X2 2V5REF FB 5VREF_PWM_AVG 0 N041 0 voltage_amp params: GAIN=10k
E2 2V5REF 0 N034 0 1.0
RL2 0 N15V_SEC 100
C8 N013 N15V_SEC 10µ
X§T2 IN N010 N014 0 ideal_dc_xfmr_alt params: N_pri={Nturns_pri} N_sec={Nturns_sec}
D12 N15V_SEC N016 1N4148
RL3 P15V_SEC 0 50
C9 N007 0 10µ
X§T3 IN N010 N011 N002 ideal_dc_xfmr_alt params: N_pri={Nturns_pri} N_sec={Nturns_sec}
D13 N004 P15V_SEC 1N4148
RL4 BUS_PLUS_15V IN 1k
C10 N006 IN 10µ
X§T4 IN N010 N009 N001 ideal_dc_xfmr_alt params: N_pri={Nturns_pri} N_sec={Nturns_sec}
D14 N001 BUS_PLUS_15V 1N4148
RDC_1 N004 N003 {RDC_78}
RDC_2 0 N012 {RDC_9_10}
LLKG_1 N003 N002 {LLKG_78}
Cp_1 N005 N002 {Cp_78}
RP_1 N005 N002 5k
LLKG_2 N012 N011 {LLKG_9_10}
Cp_2 N005 N011 {Cp_9_10}
RP_2 N005 N011 5k
RDC_3 0 N020 {RDC_56}
LLKG_3 N020 N019 {LLKG_56}
Cp_3 N017 N019 {Cp_56}
RP_3 N017 N019 5k
RDC_4 N016 N015 {RDC_43}
LLKG_4 N015 N014 {LLKG_43}
Cp_4 0 N014 {Cp_43}
RP_4 0 N014 5k
RDC_5 N008 IN {RDC_21}
LLKG_5 N008 N009 {LLKG_21}
Cp_5 N001 N009 {Cp_21}
RP_5 N001 N009 5k
S1 0 N047 N048 0 SW
R17 P15V_PRI N047 {15/0.1}
V3 N048 0 PULSE(0 5 9 100n 100n 10m)
Cp_AB1 IN N023 {Cp_AB}
RP_AB1 IN N023 5k
L1 0 N013 {L_ESL_COUT} Rser={R_ESR_COUT}
L2 P15V_PRI N018 {L_ESL_COUT} Rser={R_ESR_COUT}
L3 P15V_SEC N007 {L_ESL_COUT} Rser={R_ESR_COUT}
L4 BUS_PLUS_15V N006 {L_ESL_COUT} Rser={R_ESR_COUT}
E3 N028 0 N029 0 2.0
E4 DUTY 0 N043 0 1.0
T5 N043 0 N044 0 Td=300n Z0=50
R18 N028 N044 40
R19 0 N043 50

* block symbol definitions
.subckt ccm-dcm2 5 1 2 3 4
B§Eu1 N001 0 V={MAX(v(5), v(5)*v(5)/(v(5)*v(5)+2*{L}*{n}*{Fsw}*i(Va)/v(3,4)))}
B§Et 1 2 V={(1-v(u))*v(3,4)/v(u)/{n}}
B§Gd 4 3 I={(1-v(u))*i(Et)/v(u)/{n}}
B§Ga 0 N003 I={MAX(i(Et),0)}
Va N003 N004 0
Rdummy N004 0 10
E1 N002 0 N001 0 1.0
R2 u N002 1
D1 u N005 Dideal
V1 N005 0 1
R1 5 0 10Meg
R4 2 0 1G
R5 3 0 1G
* n =  Sec side Turns Divided
* by Pri side Turns ratio
.param L=10u
.param n = 1
.param Fsw = 100k
* *IMPORTANT! If using in a non-isolated application, set n=1
.ends ccm-dcm2

.subckt ideal_dc_xfmr_alt PRI+ PRI- SEC+ SEC-
B_V2 SEC+ SEC- V={{n}*(V(PRI+)-V(PRI-))}
B_I1 PRI+ PRI- I={-{n}*I(B_V2)}
R1 PRI- 0 1G
R2 SEC- 0 1G
.param N_pri=1
.param N_sec=1
.param n = ({N_sec}/{N_pri})
.ends ideal_dc_xfmr_alt

.subckt voltage_amp IN+ IN- Max Min Out Out_Rtn
R1 N001 IN+ 1G
R2 Max N001 1G
R3 N001 IN- 1G
R4 Min N001 1G
R5 Out_Rtn N001 100Meg
B1 N002 Out_Rtn V= { Limit ( Gain*(V(in+)-V(in-)), V(min)-V(Out_Rtn), V(max)-V(Out_Rtn) ) }
R6 N003 N002 1k
C1 N003 Out_Rtn 100p
E1 Out Out_Rtn N003 Out_Rtn 1
.ends voltage_amp

.model D D
.lib standard.dio
.model NPN NPN
.model PNP PNP
.lib standard.bjt
.tran 0 10 0 startup
.model SW SW(Ron=10m, Roff=10Meg, Vt=2.5, Vh=-0.1)
.param Fs=200.0E3
.param Ts = 1.0/Fs
.param D = 0.15
.param Rsns = 0.2
.param RL = 1k
.model Dideal D(Ron=10m Roff=10Meg Vfwd=1m Vrev=200)
.param Lm = 10u
.param Lp = 10
.param Nturns_pri = 8
.param Nturns_sec = 12
.param Ns_div_Np = {Nturns_sec/Nturns_pri}
.param Ls = ({Ns_div_Np}*{Ns_div_Np}*{Lp})
.param n = {Ns_div_Np}
* *Emulate open-collector output of EA
* and emulate max sink current of EA
* *Allows for user to drive controller
* with external Err Amp
.savebias bias.txt time=2
.loadbias bias.txt
* .ac dec 1k 1 10Meg
* Step 0. Ensure all voltage references and bias voltages are correct.
* Step 1. Reflect/Reference diode on control output winding to primary side. Leave other diodes remaining to emulate loss.
* Step 2. Set turns ratio parameter of averaged switch/diode circuit to 1
* Step 3. Configure peak-current sense block correctly.
* VL_P = Most positive voltage of magnetizing inductor when switch is ON (+VIN for this flyback)
* VL_N = Most negative voltage of magnetizing inductor when switch is ON (GND for this flyback)
* V_ILAvg = Averaged magnetizing inductor current when switch is ON, which is equal to the average switch current
* Step 4. Use high-gain voltage amp to drive feedback such that EA_OUT = Scaled peak current sense,
* which equates to peak current mode control.
* Step 5. Wire external compensator/feedback.
.param L_AB = 9.53u
.param L_21 = 22.0u
.param L_43 = 22.3u
.param L_56 = 22.3u
.param L_78 = 2.50u
.param L_9_10 = 9.03u
.param RDC_AB 32.5m
.param RDC_21 = 80m
.param RDC_43 = 70m
.param RDC_56 = 90m
.param RDC_78 = 8m
.param RDC_9_10 = 20m
.param RCNVG 1G
.param LLKG_AB = 500n
.param LLKG_21 = 500n
.param LLKG_43 = 1.75u
.param LLKG_56 = 250n
.param LLKG_78 = 175n
.param LLKG_9_10 =125n
.param Cp_AB = 30p
.param Cp_21 = 30p
.param Cp_43 = 30p
.param Cp_56 = 30p
.param Cp_78 = 30p
.param Cp_9_10 = 30p
.param RTERM1 10G
.param RTERM2 10n
* Load Step
.options
+ Gmin = 1e-10
+ Abstol = 1e-10
+ Reltol = 0.0001
+ Chgtol = 1e-10
+ Trtol = 2
+ vntol = 0.0001
+ Sstol = 0.001
+ MinDeltaGmin = 0.0001
+ Method = Gear
.param L_ESL_COUT = 10n
.param R_ESR_COUT = 10m
.backanno
.end